# EAGLE schematic Project Tango (EAGLE 9.6.2)
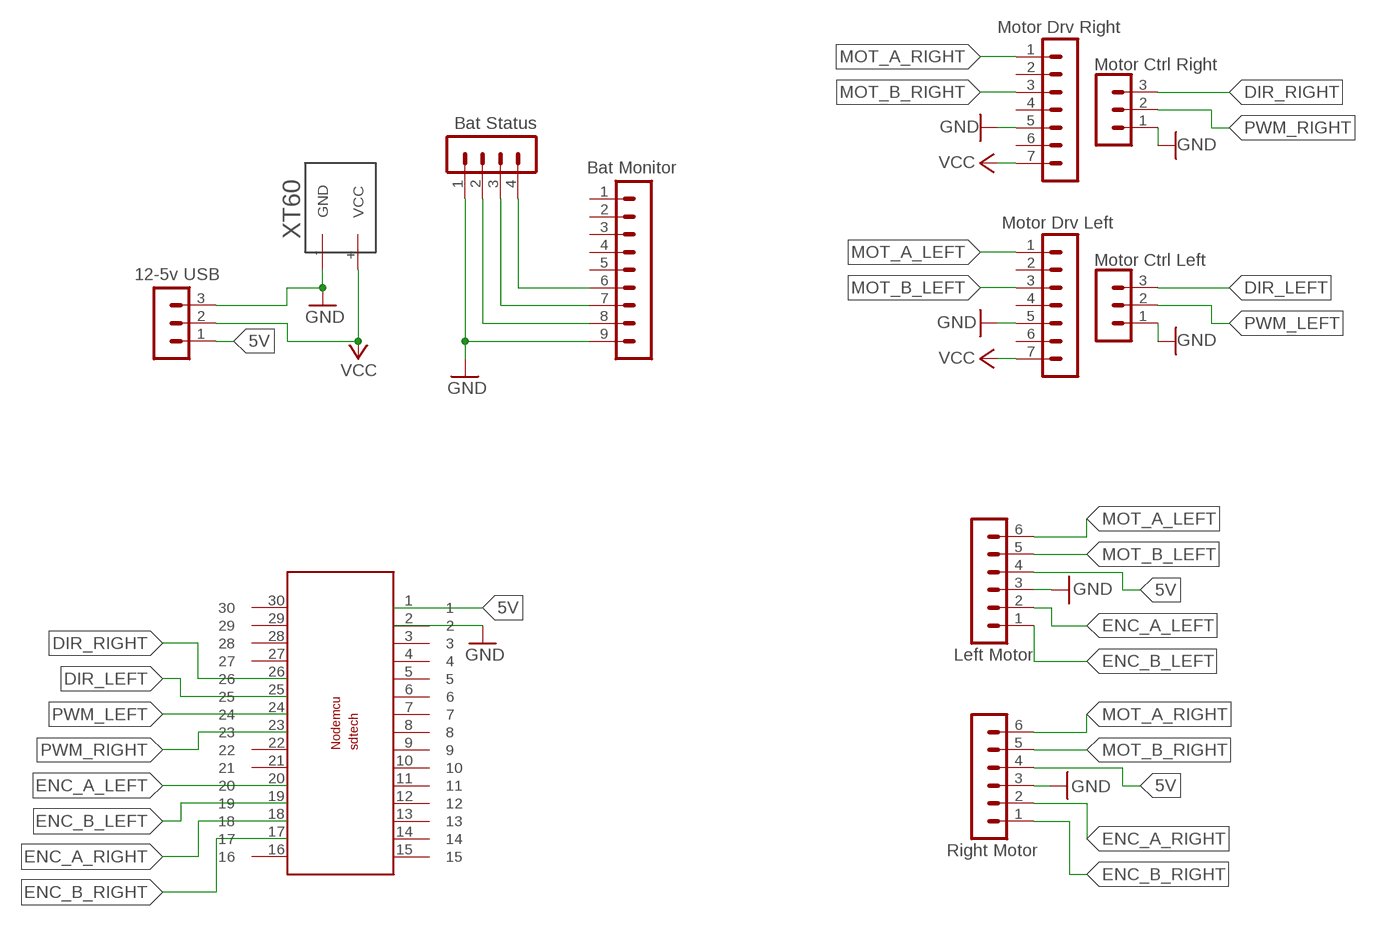
[diagram p0: schematic, sheet 1]

## Parts
BAT_MONITOR  Bat Monitor  MA09-1  [MA09-1]
BAT_STATUS  Bat Status  MA04-1  [MA04-1]
LEFTMOTOR  Left Motor  MA06-1  [MA06-1]
MOTORDRV_RIGHT  Motor Drv Right  MA07-1  [MA07-1]
SV1  12-5v USB  MA03-1  [MA03-1]
SV2  Right Motor  MA06-1  [MA06-1]
SV3  Motor Drv Left  MA07-1  [MA07-1]
SV5  Motor Ctrl Right  MA03-1  [MA03-1]
SV6  Motor Ctrl Left  MA03-1  [MA03-1]
U$1  Node MCU  NODEMCUESP8266  [NODEMCUESP8266]
U$2  XT60  [XT60]

## Nets
5V: LEFTMOTOR.4 SV1.1 SV2.4 U$1.1
DIR_LEFT: SV6.3 U$1.25
DIR_RIGHT: SV5.3 U$1.26
ENC_A_LEFT: LEFTMOTOR.2 U$1.20
ENC_A_RIGHT: SV2.2 U$1.18
ENC_B_LEFT: LEFTMOTOR.1 U$1.19
ENC_B_RIGHT: SV2.1 U$1.17
GND: BAT_MONITOR.9 BAT_STATUS.1 LEFTMOTOR.3 MOTORDRV_RIGHT.5 SV1.3 SV2.3 SV3.5 SV5.1 SV6.1 U$1.2 U$2.-(GND)
MOT_A_LEFT: LEFTMOTOR.6 SV3.1
MOT_A_RIGHT: MOTORDRV_RIGHT.1 SV2.6
MOT_B_LEFT: LEFTMOTOR.5 SV3.3
MOT_B_RIGHT: MOTORDRV_RIGHT.3 SV2.5
N$2: BAT_MONITOR.8 BAT_STATUS.2
N$3: BAT_MONITOR.7 BAT_STATUS.3
N$4: BAT_MONITOR.6 BAT_STATUS.4
PWM_LEFT: SV6.2 U$1.24
PWM_RIGHT: SV5.2 U$1.23
VCC: MOTORDRV_RIGHT.7 SV1.2 SV3.7 U$2.+(VCC)
Unconnected: BAT_MONITOR.1 BAT_MONITOR.2 BAT_MONITOR.3 BAT_MONITOR.4 BAT_MONITOR.5 MOTORDRV_RIGHT.2 MOTORDRV_RIGHT.4 MOTORDRV_RIGHT.6 SV3.2 SV3.4 SV3.6 U$1.3 U$1.4 U$1.5 U$1.6 U$1.7 U$1.8 U$1.9 U$1.10 U$1.11 U$1.12 U$1.13 U$1.14 U$1.15 U$1.16 U$1.21 U$1.22 U$1.27 U$1.28 U$1.29 U$1.30

## Library data of the parts
BAT_MONITOR = con-lstb:MA09-1: PIN HEADER; OC_FARNELL: unknown; OC_NEWARK: unknown
BAT_STATUS = con-lstb:MA04-1: PIN HEADER; OC_FARNELL: unknown; OC_NEWARK: unknown
LEFTMOTOR SV2 = con-lstb:MA06-1: PIN HEADER; OC_FARNELL: unknown; OC_NEWARK: unknown
MOTORDRV_RIGHT SV3 = con-lstb:MA07-1: PIN HEADER; OC_FARNELL: unknown; OC_NEWARK: unknown
SV1 SV5 SV6 = con-lstb:MA03-1: PIN HEADER; OC_FARNELL: unknown; OC_NEWARK: unknown
U$1 = NODEMCU:NODEMCUESP8266: Node Mcu esp8266 12E LIBRARY BY SDTECH ROBOTICS (Shubham Devkar Technology Solutions)
U$2 = XT60:XT60: XT60